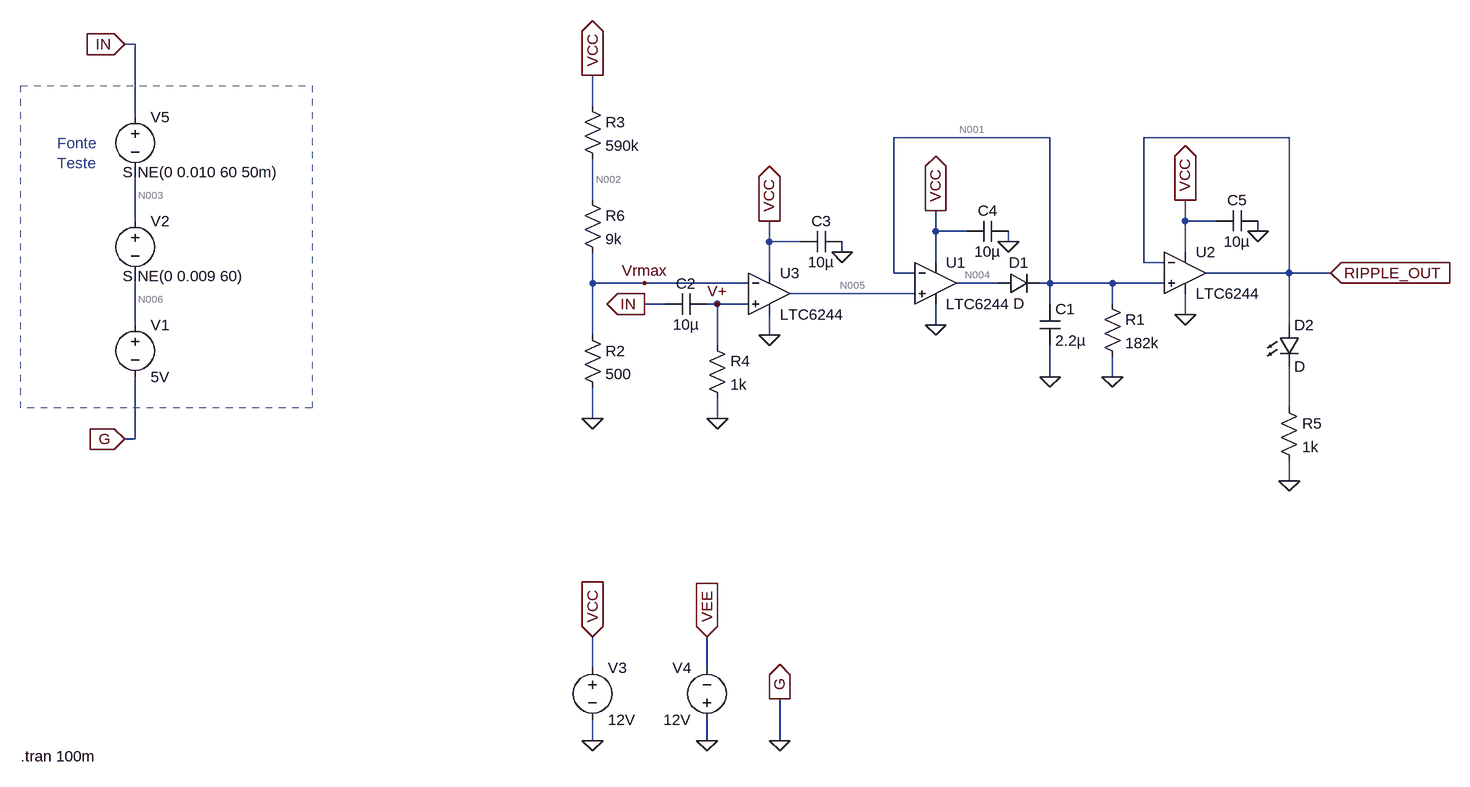
[diagram p0: schematic ripple.asc]
ripple.asc, the LTspice schematic file:
Version 4
SHEET 1 1824 840
WIRE -224 -272 -240 -272
WIRE 480 -176 480 -224
WIRE -224 -160 -224 -272
WIRE 1184 -128 944 -128
WIRE 1552 -128 1328 -128
WIRE 480 -32 480 -96
WIRE -224 0 -224 -80
WIRE 1392 0 1392 -32
WIRE 1440 0 1392 0
WIRE 1008 16 1008 -16
WIRE 1056 16 1008 16
WIRE 1504 16 1504 0
WIRE 752 32 752 0
WIRE 800 32 752 32
WIRE 1120 32 1120 16
WIRE 864 48 864 32
WIRE 1392 48 1392 0
WIRE 1008 64 1008 16
WIRE 1328 64 1328 -128
WIRE 1360 64 1328 64
WIRE 752 80 752 32
WIRE 944 80 944 -128
WIRE 976 80 944 80
WIRE 1552 80 1552 -128
WIRE 1552 80 1424 80
WIRE 1616 80 1552 80
WIRE 480 96 480 48
WIRE 560 96 480 96
WIRE 720 96 560 96
WIRE 1104 96 1040 96
WIRE 1184 96 1184 -128
WIRE 1184 96 1168 96
WIRE 1280 96 1184 96
WIRE 1360 96 1280 96
WIRE 976 112 784 112
WIRE 592 128 560 128
WIRE 672 128 656 128
WIRE 720 128 672 128
WIRE 1184 128 1184 96
WIRE 1280 128 1280 96
WIRE 1392 144 1392 112
WIRE -224 160 -224 80
WIRE 1008 160 1008 128
WIRE 1552 160 1552 80
WIRE 480 176 480 96
WIRE 752 176 752 144
WIRE 672 192 672 128
WIRE 1184 240 1184 192
WIRE 1280 240 1280 208
WIRE 1552 288 1552 224
WIRE 480 304 480 256
WIRE 672 304 672 272
WIRE -224 336 -224 240
WIRE -224 336 -240 336
WIRE 1552 400 1552 368
WIRE 480 688 480 640
WIRE 656 688 656 640
WIRE 480 800 480 768
WIRE 656 800 656 768
WIRE 768 800 768 736
FLAG 480 800 0
FLAG 768 736 G
IOPIN 768 736 Out
FLAG 768 800 0
FLAG 480 640 VCC
IOPIN 480 640 In
FLAG 656 800 0
FLAG 656 640 VEE
IOPIN 656 640 In
FLAG 1184 240 0
FLAG 1280 240 0
FLAG 1008 160 0
FLAG 1392 144 0
FLAG 480 304 0
FLAG 480 -224 VCC
IOPIN 480 -224 Out
FLAG 560 128 IN
IOPIN 560 128 Out
FLAG 672 304 0
FLAG 752 176 0
FLAG 1552 400 0
FLAG 752 0 VCC
IOPIN 752 0 Out
FLAG 864 48 0
FLAG 1008 -16 VCC
IOPIN 1008 -16 Out
FLAG 1120 32 0
FLAG 1392 -32 VCC
IOPIN 1392 -32 Out
FLAG 1504 16 0
FLAG 1616 80 RIPPLE_OUT
IOPIN 1616 80 In
FLAG -240 -272 IN
IOPIN -240 -272 In
FLAG -240 336 G
IOPIN -240 336 In
FLAG 560 96 Vrmax
FLAG 672 128 V+
SYMBOL voltage 480 672 R0
SYMATTR InstName V3
SYMATTR Value 12V
SYMBOL voltage 656 784 R180
WINDOW 0 24 96 Left 2
WINDOW 3 24 16 Left 2
SYMATTR InstName V4
SYMATTR Value 12V
SYMBOL OpAmps\\LTC6244 1008 96 R0
SYMATTR InstName U1
SYMBOL diode 1104 112 R270
WINDOW 0 32 32 VTop 2
WINDOW 3 0 32 VBottom 2
SYMATTR InstName D1
SYMBOL cap 1168 128 R0
SYMATTR InstName C1
SYMATTR Value 2.2µ
SYMBOL res 1264 112 R0
SYMATTR InstName R1
SYMATTR Value 182k
SYMBOL OpAmps\\LTC6244 1392 80 R0
SYMATTR InstName U2
SYMBOL res 464 160 R0
SYMATTR InstName R2
SYMATTR Value 500
SYMBOL res 464 -192 R0
SYMATTR InstName R3
SYMATTR Value 590k
SYMBOL cap 656 112 R90
WINDOW 0 0 32 VBottom 2
WINDOW 3 32 32 VTop 2
SYMATTR InstName C2
SYMATTR Value 10µ
SYMBOL res 656 176 R0
SYMATTR InstName R4
SYMATTR Value 1k
SYMBOL LED 1536 160 R0
SYMATTR InstName D2
SYMBOL OpAmps\\LTC6244 752 112 R0
SYMATTR InstName U3
SYMBOL res 1536 272 R0
SYMATTR InstName R5
SYMATTR Value 1k
SYMBOL cap 864 16 R90
WINDOW 0 0 32 VBottom 2
WINDOW 3 32 32 VTop 2
SYMATTR InstName C3
SYMATTR Value 10µ
SYMBOL cap 1120 0 R90
WINDOW 0 0 32 VBottom 2
WINDOW 3 32 32 VTop 2
SYMATTR InstName C4
SYMATTR Value 10µ
SYMBOL cap 1504 -16 R90
WINDOW 0 0 32 VBottom 2
WINDOW 3 32 32 VTop 2
SYMATTR InstName C5
SYMATTR Value 10µ
SYMBOL res 464 -48 R0
SYMATTR InstName R6
SYMATTR Value 9k
SYMBOL voltage -224 144 R0
SYMATTR InstName V1
SYMATTR Value 5V
SYMBOL voltage -224 -16 R0
WINDOW 123 0 0 Left 0
WINDOW 39 0 0 Left 0
WINDOW 3 -19 101 Left 2
SYMATTR Value SINE(0 0.009 60)
SYMATTR InstName V2
SYMBOL voltage -224 -176 R0
WINDOW 123 0 0 Left 0
WINDOW 39 0 0 Left 0
WINDOW 3 -19 101 Left 2
SYMATTR Value SINE(0 0.010 60 50m)
SYMATTR InstName V5
TEXT -344 -120 Left 2 ;Fonte\nTeste
TEXT -400 824 Left 2 !.tran 100m
RECTANGLE Normal -400 -208 48 288 2

The netlist it stands for:
* ripple.asc
V3 VCC 0 12V
V4 0 VEE 12V
XU1 N005 N001 VCC 0 N004 LTC6244  ; pins In+ In- V+ V- OUT
D1 N004 N001 D
C1 N001 0 2.2µ
R1 N001 0 182k
XU2 N001 RIPPLE_OUT VCC 0 RIPPLE_OUT LTC6244  ; pins In+ In- V+ V- OUT
R2 Vrmax 0 500
R3 VCC N002 590k
C2 V+ IN 10µ
R4 V+ 0 1k
D2 RIPPLE_OUT N007 D
XU3 V+ Vrmax VCC 0 N005 LTC6244  ; pins In+ In- V+ V- OUT
R5 N007 0 1k
C3 0 VCC 10µ
C4 0 VCC 10µ
C5 0 VCC 10µ
R6 N002 Vrmax 9k
V1 N006 0 5V
V2 N003 N006 SINE(0 0.009 60)
V5 IN N003 SINE(0 0.010 60 50m)
.model D D
.lib standard.dio
* Fonte
* Teste
.tran 100m
.backanno
.end

* Results of the author's LTspice run, read from the files saved beside the schematic
* Operating Point, zero values left out:
*   V(vcc) = 12 V
*   V(vee) = -12 V
*   V(n001) = 556.2 µV
*   V(n005) = -85.24 µV
*   V(n004) = 327.2 mV
*   V(ripple_out) = 1.188 mV
*   V(vrmax) = 10.01 mV
*   V(n002) = 190.2 mV
*   V(in) = 5 V
*   V(n006) = 5 V
*   V(n003) = 5 V
*   I(D1) = 3.056 nA
*   I(R6) = 20.02 µA
*   I(R3) = 20.02 µA
*   I(R2) = 20.02 µA
*   I(R1) = 3.056 nA
*   I(V3) = -3.795 mA
*   Ix(u1:3) = 3.75 mA
*   Ix(u1:4) = -3.75 mA
*   Ix(u1:5) = -3.045 nA
*   Ix(u2:3) = 25.33 µA
*   Ix(u2:4) = -25.32 µA
*   Ix(u2:5) = 12 pA
*   Ix(u3:3) = 1.377 nA
*   Ix(u3:4) = 2.416 µA
*   Ix(u3:5) = 12 pA
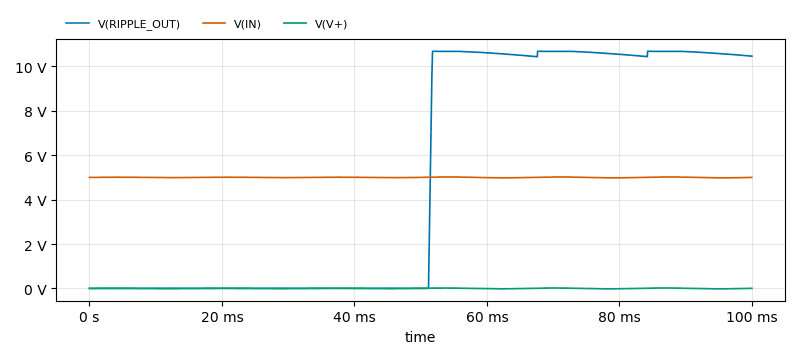
[diagram p1: Transient Analysis of ripple.asc, plotted from the saved traces]
* Transient Analysis, 1 run:
*   V(RIPPLE_OUT): min 1.188 mV, max 10.68 V, average 5.148 V, rms 7.381 V, last 10.46 V
*   V(IN): min 4.981 V, max 5.019 V, average 5 V, rms 5 V, last 5 V
*   V(V+): min -19.04 mV, max 18.3 mV, average -448.6 µV, rms 10.02 mV, last 4.691 mV